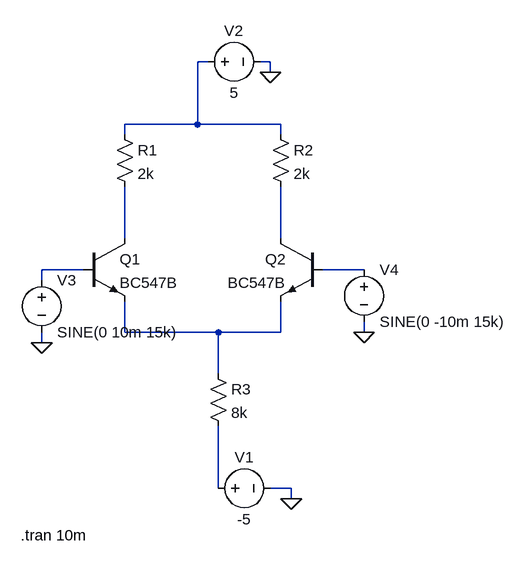
[diagram p0: schematic PREAMPLIFIER.asc]
PREAMPLIFIER.asc, the LTspice schematic file:
Version 4.1
SHEET 1 880 680
WIRE 288 -160 272 -160
WIRE 384 -160 368 -160
WIRE 384 -144 384 -160
WIRE 272 -64 272 -160
WIRE 272 -64 160 -64
WIRE 400 -64 272 -64
WIRE 160 -48 160 -64
WIRE 400 -48 400 -64
WIRE 160 112 160 32
WIRE 400 112 400 32
WIRE 96 160 32 160
WIRE 528 160 464 160
WIRE 32 176 32 160
WIRE 160 256 160 208
WIRE 304 256 160 256
WIRE 400 256 400 208
WIRE 400 256 304 256
WIRE 528 256 528 240
WIRE 32 272 32 256
WIRE 304 320 304 256
WIRE 304 496 304 400
WIRE 416 496 384 496
WIRE 416 512 416 496
FLAG 32 272 0
FLAG 528 256 0
FLAG 384 -144 0
FLAG 416 512 0
SYMBOL npn 96 112 R0
SYMATTR InstName Q1
SYMATTR Value BC547B
SYMBOL npn 464 112 M0
SYMATTR InstName Q2
SYMATTR Value BC547B
SYMBOL res 144 -64 R0
SYMATTR InstName R1
SYMATTR Value 2k
SYMBOL res 384 -64 R0
SYMATTR InstName R2
SYMATTR Value 2k
SYMBOL res 288 304 R0
SYMATTR InstName R3
SYMATTR Value 8k
SYMBOL voltage 288 496 R270
WINDOW 0 32 56 VTop 2
WINDOW 3 -32 56 VBottom 2
WINDOW 123 0 0 Left 0
WINDOW 39 0 0 Left 0
SYMATTR InstName V1
SYMATTR Value -5
SYMBOL voltage 272 -160 R270
WINDOW 0 32 56 VTop 2
WINDOW 3 -32 56 VBottom 2
WINDOW 123 0 0 Left 0
WINDOW 39 0 0 Left 0
SYMATTR InstName V2
SYMATTR Value 5
SYMBOL voltage 32 160 R0
WINDOW 123 0 0 Left 0
WINDOW 39 0 0 Left 0
SYMATTR InstName V3
SYMATTR Value SINE(0 10m 15k)
SYMBOL voltage 528 144 R0
WINDOW 123 0 0 Left 0
WINDOW 39 0 0 Left 0
SYMATTR InstName V4
SYMATTR Value SINE(0 -10m 15k)
TEXT 0 568 Left 2 !.tran 10m

The netlist it stands for:
* PREAMPLIFIER.asc
Q1 N002 N004 N006 0 BC547B
Q2 N003 N005 N006 0 BC547B
R1 N001 N002 2k
R2 N001 N003 2k
R3 N006 N007 8k
V1 N007 0 -5
V2 N001 0 5
V3 N004 0 SINE(0 10m 15k)
V4 N005 0 SINE(0 -10m 15k)
.model NPN NPN
.model PNP PNP
.lib standard.bjt
.tran 10m
.backanno
.end